# EAGLE design WorkshySwitch (EAGLE 9.4.2)
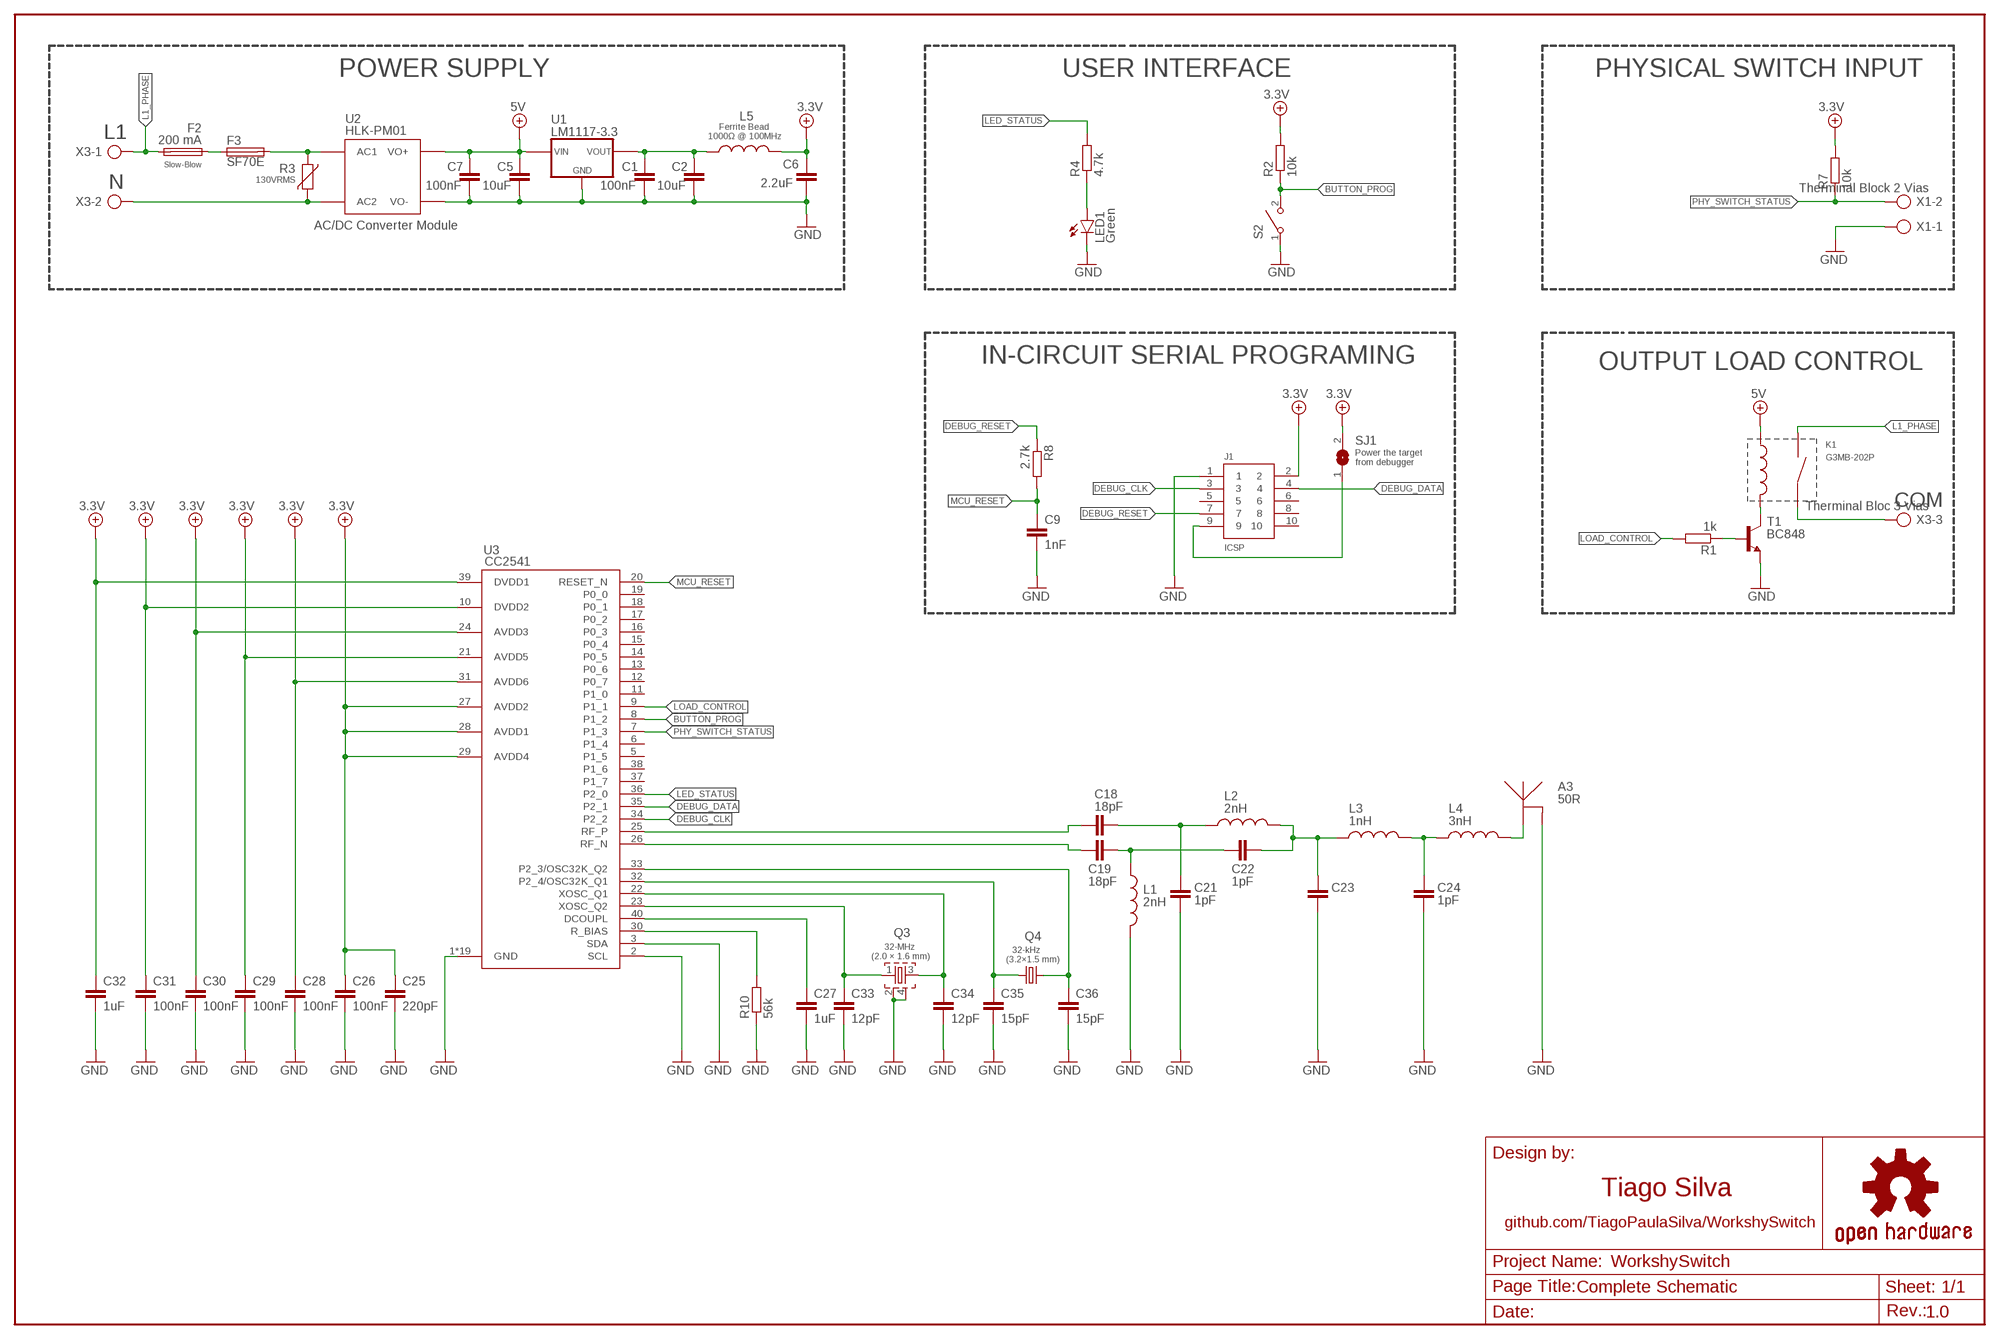
[diagram p0: schematic, sheet 1]

## Parts
A3  50R  ANTENNA  [MIFA]
C1  100nF  C-EUC0603  [C0603]
C2  10uF  C-EUC0603  [C0603]
C5  10uF  C-EUC0603  [C0603]
C6  2.2uF  C0402  [C0402]
C7  100nF  C-EUC0603  [C0603]
C9  1nF  C0402  [C0402]
C18  18pF  C0402  [C0402]
C19  18pF  C0402  [C0402]
C21  1pF  C0402  [C0402]
C22  1pF  C0402  [C0402]
C23  C0402  [C0402]
C24  1pF  C0402  [C0402]
C25  220pF  C0402  [C0402]
C26  100nF  C0402  [C0402]
C27  1uF  C0402  [C0402]
C28  100nF  C0402  [C0402]
C29  100nF  C0402  [C0402]
C30  100nF  C0402  [C0402]
C31  100nF  C0402  [C0402]
C32  1uF  C0402  [C0402]
C33  12pF  C0402  [C0402]
C34  12pF  C0402  [C0402]
C35  15pF  C0402  [C0402]
C36  15pF  C0402  [C0402]
F2  200 mA  QPL  [QPL]
F3  SF70E  LITTLEFUSE  [LITTLEFUSE]
J1  ICSP  SHF-105-01-X-D-SM  [SHF-105-01-X-D-SM]
K1  G3MB-202P  G3MB202PDC12  [RELAY_G3MB202PDC12]
L1  2nH  L0402  [C0402]
L2  2nH  L0402  [C0402]
L3  1nH  L0402  [C0402]
L4  3nH  L0402  [C0402]
L5  Ferrite Bead  L0402  [C0402]
LED1  Green  LEDCHIP-LED0805  [CHIP-LED0805]
Q3  32-MHz  FA-128  [FA-128]
Q4  32-kHz  KX-327-NHF  [3.2X1.5]
R1  1k  R0402  [C0402]
R2  10k  R0402  [C0402]
R3  130VRMS  VARISTORS05K11  [S05K11]
R4  4.7k  R0402  [C0402]
R7  10k  R0402  [C0402]
R8  2.7k  R0402  [C0402]
R10  56k  R0402  [C0402]
S2  434121050816  [434121050816]
SJ1  Jumper  SJ  [SJ]
T1  BC848  [SOT23]
U1  LM1117-3.3  REG1117  [SOT223]
U2  HLK-PM01  [HLK-PM01]
U3  CC2541  CC2541F256RHAT  [QFN50P600X600X100-41N]
X1  Therminal Block 2 Vias  AK500/2  [AK500/2]
X3  Therminal Bloc 3 Vias  AK500/3  [AK500/3]

## Nets
3.3: C1.1 C2.1 L5.2 U1.2(VOUT) U1.4(VOUT)
3.3V: C6.1 C25.1 C26.1 C28.1 C29.1 C30.1 C31.1 C32.1 J1.2 L5.1 R2.2 R7.2 SJ1.2 U3.10(DVDD2) U3.21(AVDD5) U3.24(AVDD3) U3.27(AVDD2) U3.28(AVDD1) U3.29(AVDD4) U3.31(AVDD6) U3.39(DVDD1)
5V: C5.1 C7.1 K1.3(+) U1.3(VIN) U2.P$4(VO+)
BUTTON_PROG: R2.1 S2.2 U3.8(P1_2)
DEBUG_CLK: J1.3 U3.34(P2_2)
DEBUG_DATA: J1.4 U3.35(P2_1)
DEBUG_RESET: J1.7 R8.1
GND [gnd]: A3.GND C1.2 C2.2 C5.2 C6.2 C7.2 C9.2 C21.2 C23.1 C24.2 C25.2 C26.2 C27.2 C28.2 C29.2 C30.2 C31.2 C32.2 C33.2 C34.2 C35.2 C36.2 J1.1 L1.2 LED1.C Q3.2 Q3.4 R10.1 S2.1 T1.2(E) U1.1(GND) U2.P$3(VO-) U3.1(GND) U3.2(SCL) U3.3(SDA) U3.4(GND) U3.41(GND) U3.42(GND) U3.43(GND) U3.44(GND) U3.45(GND) U3.46(GND) U3.47(GND) U3.48(GND) U3.49(GND) U3.50(GND) U3.51(GND) U3.52(GND) U3.53(GND) U3.54(GND) U3.55(GND) U3.56(GND) U3.57(GND) X1.1
L1_PHASE: F2.2 K1.1(L1) X3.1
LED_STATUS: R4.2 U3.36(P2_0)
LOAD_CONTROL: R1.2 U3.9(P1_1)
MCU_RESET: C9.1 R8.2 U3.20(RESET_N)
N$1: LED1.A R4.1
N$3: R3.2 U2.P$2(AC2) X3.2
N$4: F3.2 R3.1 U2.P$1(AC1)
N$5: K1.4(-) T1.3(C)
N$6: R1.1 T1.1(B)
N$8: K1.2(L2) X3.3
N$9: F2.1 F3.1
N$10: J1.9 SJ1.1
N$11: C18.1 U3.25(RF_P)
N$12: C19.1 C22.2 L1.1
N$13: C22.1 C23.2 L2.2 L3.1
N$14: C19.2 U3.26(RF_N)
N$15: C18.2 C21.1 L2.1
N$44: C24.1 L3.2 L4.1
N$45: A3.FEED L4.2
N$46: C27.1 U3.40(DCOUPL)
N$47: R10.2 U3.30(R_BIAS)
N$48: C33.1 Q3.1 U3.23(XOSC_Q2)
N$49: C34.1 Q3.3 U3.22(XOSC_Q1)
N$50: C35.1 Q4.1 U3.32(P2_4/OSC32K_Q1)
N$51: C36.1 Q4.2 U3.33(P2_3/OSC32K_Q2)
PHY_SWITCH_STATUS: R7.1 U3.7(P1_3) X1.2
Unconnected: J1.5 J1.6 J1.8 J1.10 U3.5(P1_5) U3.6(P1_4) U3.11(P1_0) U3.12(P0_7) U3.13(P0_6) U3.14(P0_5) U3.15(P0_4) U3.16(P0_3) U3.17(P0_2) U3.18(P0_1) U3.19(P0_0) U3.37(P1_7) U3.38(P1_6)

## Notes on the sheet
- POWER SUPPLY
- USER INTERFACE | PHYSICAL SWITCH INPUT
- L1 | 1000Ω @ 100MHz
- Slow-Blow
- N
- AC/DC Converter Module
- IN-CIRCUIT SERIAL PROGRAMING | OUTPUT LOAD CONTROL
- Power the target
  from debugger
- COM
- (2.0 × 1.6 mm)
- (3.2×1.5 mm)
- Tiago Silva
- github.com/TiagoPaulaSilva/WorkshySwitch
- Complete Schematic
- 1.0

## Library data of the parts
A3 = PCB Antenna:ANTENNA: This is a PCB Inverted F Antenna (IFA). This IFA was designed to match an impedance of 50 ohms at 2.45 GHz. Thus no additional matching components are necessary. This is a copy of CC2511 USB dongle reference design.
C1 C2 C5 C7 = rcl:C-EU: CAPACITOR, European symbol; SPICEPREFIX: C
C6 C9 C18 C19 C21-C36 = smd-ipc:C0402
F2 = fuse:QPL: Fuseholder for Micro(TM) Fuse or Pico(R) II Fuses 281 005, 281 008 Source:www.littlefuse.com .. 281005A.PDF; OC_FARNELL: 1608231; OC_NEWARK: unknown
F3 = fuse:LITTLEFUSE: LITTLEFUSE Picofuse/slow Littlefuse; OC_FARNELL: unknown; OC_NEWARK: unknown
J1 = SHF-105-01-X-D-SM:SHF-105-01-X-D-SM: 0.050"X0.050" SHROUDED TERMINAL STRIP ASSEMBLY, 10PINS.; AVAILABILITY: Unavailable; DESCRIPTION: SHF Series .050 Shrouded Terminal Strip For FFSD; MF: Samtec; MP: SHF-105-01-F-D-SM; PACKAGE: None; PRICE: None
K1 = G3MB202PDC12:G3MB202PDC12: Relay 12vdc Isolation Photot; AVAILABILITY: Unavailable; DESCRIPTION: Relay • Solid-State • Phototriac • Base: PCB terminal • Amperage: 2 AMP • Coil Voltage: 24 Vdc • Configuration: SPST-...; MF: Omron Automation; MP: G3MB-202P-DC12; PACKAGE: SIP-4 Omron; PRICE: None
L1-L5 = smd-ipc:L0402
LED1 = led:LED: LED OSRAM: - CHIPLED LG R971, LG N971, LY N971, LG Q971, LY Q971, LO R971, LY R971 LH N974, LH R974 LS Q976, LO Q976, LY Q976 LO Q996 - Hyper CHIPLED LW Q18S LB Q993, LB Q99A, LB R99A - SideLED LS A670, LO A670, LY A670, LG A670, LP A670 LB A673, LV A673, LT A673, LW A673 LH A674 LY A675 LS A676, LA A676, LO A676, LY A676, LW A676 LS A679, LY A679, LG A679 - Hyper Micro SIDELED® LS Y876, LA Y876, LO Y876, LY Y876 LT Y87S - SmartLED LW L88C, LW L88S LB L89C, LB L89S, LG L890 LS L89K, LO L89K, LY L89K LS L896, LA L896, LO L896, LY L896 - TOPLED LS T670, LO T670, LY T670, LG T670, LP T670 LSG T670, LSP T670, LSY T670, LOP T670, LYG T670 LG T671, LOG T671, LSG T671 LB T673, LV T673, LT T673, LW T673 LH T674 LS T676, LA T676, LO T676, LY T676, LB T676, LH T676, LSB T676, LW T676 LB T67C, LV T67C, LT T67C, LS T67K, LO T67K, LY T67K, LW E67C LS E67B, LA E67B, LO E67B, LY E67B, LB E67C, LV E67C, LT E67C LW T67C LS T679, LY T679, LG T679 LS T770, LO T770, LY T770, LG T770, LP T770 LB T773, LV T773, LT T773, LW T773 LH T774 LS E675, LA E675, LY E675, LS T675 LS T776, LA T776, LO T776, LY T776, LB T776 LHGB T686 LT T68C, LB T68C - Hyper Mini TOPLED® LB M676 - Mini TOPLED Santana® LG M470 LS M47K, LO M47K, LY M47K Source: http://www.osram.convergy.de LUXEON: - LUMILED® LXK2-PW12-R00, LXK2-PW12-S00, LXK2-PW14-U00, LXK2-PW14-V00 LXK2-PM12-R00, LXK2-PM12-S00, LXK2-PM14-U00 LXK2-PE12-Q00, LXK2-PE12-R00, LXK2-PE12-S00, LXK2-PE14-T00, LXK2-PE14-U00 LXK2-PB12-K00, LXK2-PB12-L00, LXK2-PB12-M00, LXK2-PB14-N00, LXK2-PB14-P00, LXK2-PB14-Q00 LXK2-PR12-L00, LXK2-PR12-M00, LXK2-PR14-Q00, LXK2-PR14-R00 LXK2-PD12-Q00, LXK2-PD12-R00, LXK2-PD12-S00 LXK2-PH12-R00, LXK2-PH12-S00 LXK2-PL12-P00, LXK2-PL12-Q00, LXK2-PL12-R00 Source: www.luxeon.com KINGBRIGHT: KA-3528ASYC Source: www.kingbright.com
Q3 = crystal:FA-: MHz RANGE CRYSTAL UNIT Source: Epson Toyocom
Q4 = crystal-geyer_V1_0:KX-327: Tuning Fork Crystals (kHz) SMD: KX327 - Serie Model Size l/w/h [mm] Frequency Range Frequency Stability Temp. Range [°C] Load Capacitance AECQ 200 availabel Datasheet KX-327VT KX-327FT KX-327RT KX-327NHT KX-327NHF KX-327L KX-327S 1.25/1.05/0.5 1.6/1.0/0.5 2.0/1.2/0.6 3.2/1.5/0.8 3.2/1.5/0.8 7.0/1.5/1.4 8.2/3.8/2.5 32,768 kHz 32,768 kHz 32,768 kHz 32,768 kHz 32,768 kHz 32,768 kHz 32,768 kHz ±10 … ±20ppm ±10 … ±20ppm ±10 … ±20ppm ±10 … ±20ppm ±10 … ±20ppm ±10 … ±20ppm ±5 … ±20ppm (*) -40°C …+85°C (*) -40°C …+85°C (*) -40°C …+85°C (*) -40°C …+85°C (*) -40°C …+125°C (*) -40°C …+85°C (*) -40°C …+85°C 7/9/12,5 7/9/12,5 7/9/12,6 7/9/12,5 9/12,5 7/9/12,5 6/12,5 - - - - yes - - KX-327VT.pdf <http://www.geyer-electronic.de/uploads/tx_userartikelfrequenz/GEYER-KX-327VT.pdf> KX-327FT.pdf <http://www.geyer-electronic.de/uploads/tx_userartikelfrequenz/GEYER-KX-327FT.pdf> KX-327RT.pdf <http://www.geyer-electronic.de/uploads/tx_userartikelfrequenz/GEYER-KX-327RT.pdf> KX-327NHT.pdf <http://www.geyer-electronic.de/uploads/tx_userartikelfrequenz/GEYER-KX-327NHT.pdf> KX-327NHF.pdf <http://www.geyer-electronic.de/uploads/tx_userartikelfrequenz/GEYER-KX-327NHF.pdf> KX-327L.pdf <http://www.geyer-electronic.de/uploads/tx_userartikelfrequenz/GEYER-KX-327L.pdf> KX-327S.pdf <http://www.geyer-electronic.de/uploads/tx_userartikelfrequenz/GEYER-KX-327S.pdf> <http://www.geyer-electronic.de/fileadmin/template/img/logo-geyer-electronic.png> Details see: http://www.geyer-electronic.de/Frequenz-Produkte.9.0.html Created 2016-06-07, Hans Locher 2016 (C) Geyer Quartz Technology KX327VT,KX327FT,KX327RT,KX327NHT,KX327NHF,KX327S,KX327L;125105;1610;2012;3215;7015;8238;1,25x1,05,1.25x1.05;1,6x1,0,1.6x1.0;2,0x1,2,2.0x1.2;3,2x1,5,3.2x1.5;8,2x3,8,8.2x3.8,7.0x1.5,7,0x1,532.768kHz
R1 R2 R4 R7 R8 R10 = smd-ipc:R0402
R3 = varistor:VARISTOR: VARISTOR
S2 = Push Button:434121050816: 6.0x3.5 mm SMD WS-TASV <http://katalog.we-online.de/media/images/v2/Family_WS-TASV_6.0x3.jpg> Details see: http://katalog.we-online.de/em/datasheet/4341x1xxx8x6.pdf 2015 (C) Wurth Elektronik; AVAILABILITY: Unavailable; DESCRIPTION: Pushbutton 12 Vdc 0.05 A 1 x Off/_On_ Wuerth Elektronik 434121050816 momentary 1 pc_s_; MF: Wurth Electronics; MP: 434121050816; PACKAGE: None; PRICE: None
SJ1 = jumper:SJ: SMD solder JUMPER
T1 = transistor:BC848: NPN TRANSISTOR
U1 = REG1117:REG1117: 800mA and 1A Low Dropout (LDO) Positive Regulator 1.8V, 2.5V, 2.85V, 3.3V, 5V, and Adj; AVAILABILITY: Unavailable; DESCRIPTION: LDO Regulator Pos 1.25V to 13.5V 0.8A 4-Pin_3+Tab_ SOT-223 Tube; MF: Texas Instruments; MP: REG1117; PACKAGE: SOT-223-4 Texas Instruments; PRICE: None
U2 = HLK-PM01:HLK-PM01: HI-LINK Ultra-compact power module HLK-PM01 Meet UL, CE requirements Ultra-thin, ultra-small All voltage input (AC: 90 ~ 264V) Low ripple and low noise Output overload and short circuit protection High efficiency, high power density The product is designed to meet the requirements of EMC and Safety Test Low power consumption, environmental protection, no-load loss <0.1W 100% load aging and testing; AVAILABILITY: Unavailable; MF: Hi-link; MP: hlk-pm01; PACKAGE: Package Analog Devices; PRICE: None
U3 = CC2541F256RHAT:CC2541F256RHAT: SimpleLink Bluetooth Smart and Proprietary Wireless MCU 40-VQFN -40 to 85; AVAILABILITY: Unavailable; DESCRIPTION: SimpleLink Bluetooth Smart and Proprietary Wireless MCU 40-VQFN -40 to 85; MF: Texas Instruments; MP: CC2541F256RHAT; PACKAGE: VFQFN-40 Texas Instruments; PRICE: None
X1 = con-ptr500:AK500/2: CONNECTOR; OC_FARNELL: unknown; OC_NEWARK: unknown
X3 = con-ptr500:AK500/3: CONNECTOR; OC_FARNELL: unknown; OC_NEWARK: unknown

## Net classes
2 gnd: width 0.152 mm, drill 0.559 mm, clearance 0.254 mm

## Board
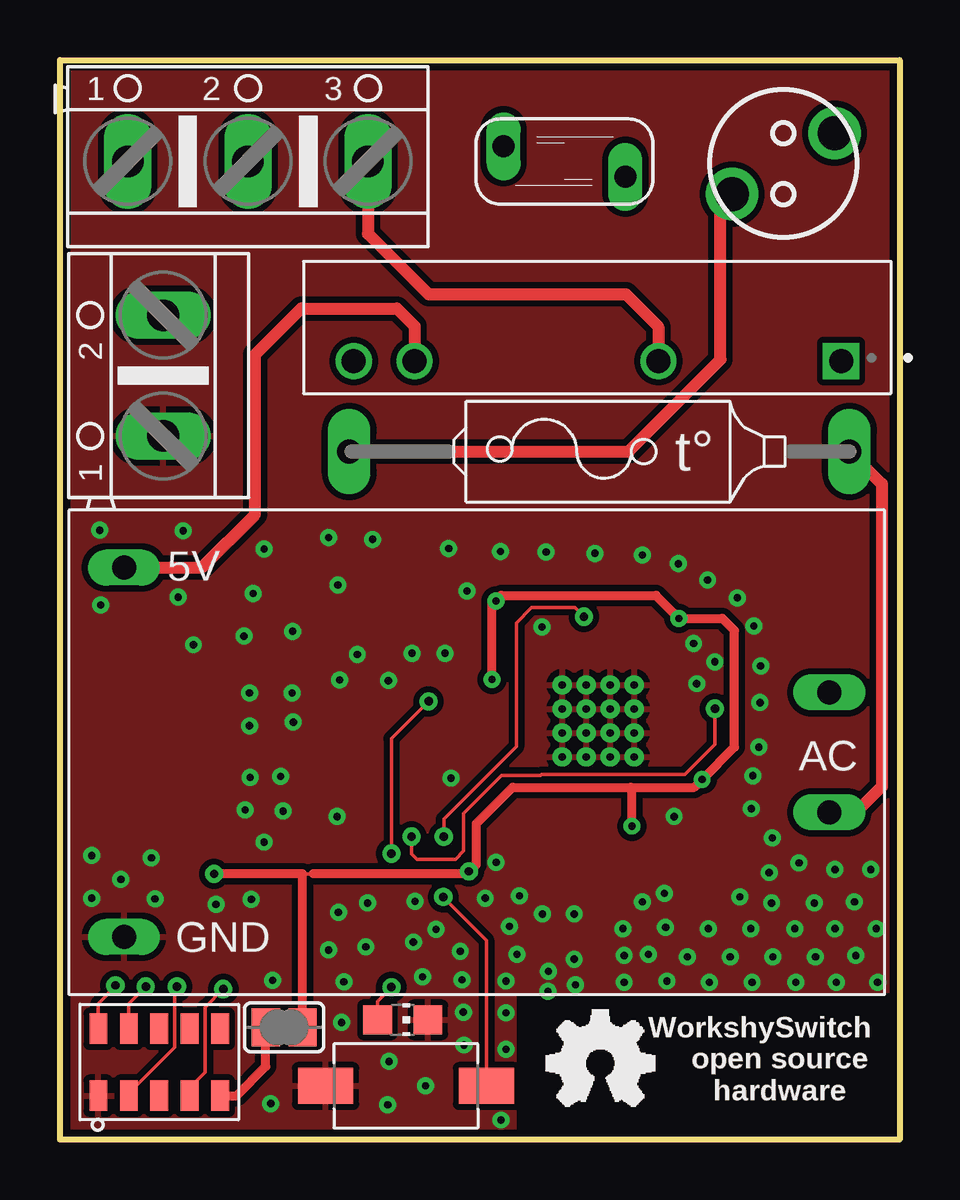
[diagram p1: board, top side]
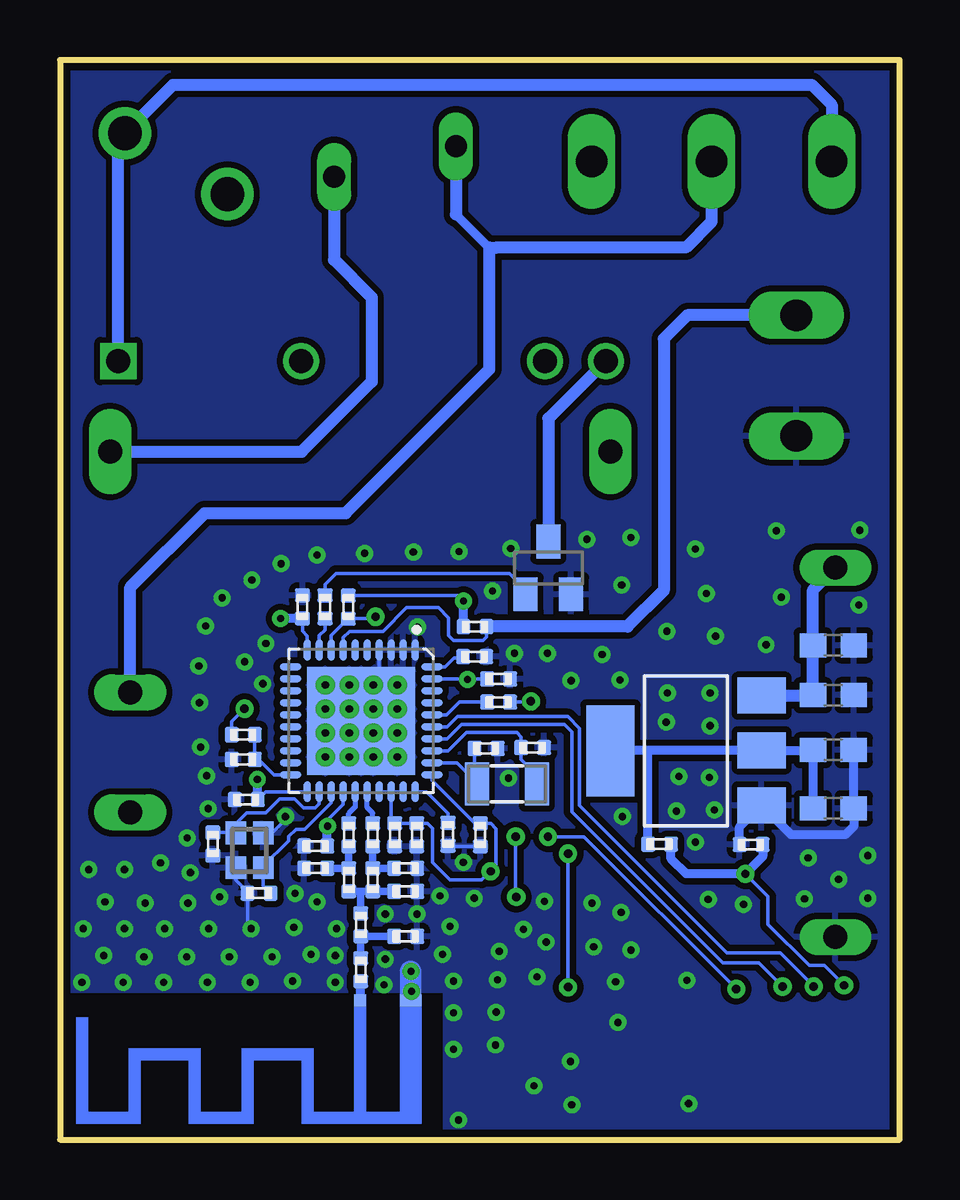
[diagram p2: board, bottom side, seen from below]

Size 35 x 45 mm. Coordinates in mm from the lower left corner, seen from the top.
Outline: 0,0 0,45 35,45 35,0 0,0
Copper layers (1*16): Top 0.035mm / dielectric 1.5mm / Bottom 0.035mm
Design rules "default *": minimum track width 6mil, minimum drill 0.3mm, track to track 6mil, track to pad 6mil, pad to pad 6mil, via to via 6mil, smd to smd 6mil, copper to edge 0.3mm, drill to drill 6mil, minimum pad ring 10mil, minimum via ring 8mil, stop-mask expansion 4mil, vias tented up to drill 0mil, thermal gap 10mil
tRestrict: area 19.1,0.3 to 34.9,6.1
bRestrict: area 19.1,0.3 to 34.9,6.1

### Footprints (pad centres in the part's own frame; a part is rotated, then mirrored left to right if it is on the bottom)
MIFA = smd 0.5 x 0.5: FEED 2.55,0.25 | smd 0.9 x 0.5: GND 0.45,0.25
C0603 = smd 1.1 x 1: 1 -0.85,0; 2 0.85,0
C0402 = smd 0.59 x 0.64: 1 -0.48,0; 2 0.48,0
QPL = drill 1.4 pad 2.184: 1 -1.27,2.139; 2 1.27,-2.139
LITTLEFUSE = drill 1 pad 1.778 long: 1 -9.88,0.2; 2 10.98,0.2
SHF-105-01-X-D-SM = smd 0.737 x 1.27: 1 -2.54,-1.27; 2 -2.54,1.524; 3 -1.27,-1.27; 4 -1.27,1.524; 5 0,-1.27; 6 0,1.524; 7 1.27,-1.27; 8 1.27,1.524; 9 2.54,-1.27; 10 2.54,1.524
RELAY_G3MB202PDC12 = drill 1 square: 1 -10.16,1.4 | drill 1: 2 -2.54,1.4; 3 7.62,1.4; 4 10.16,1.4
CHIP-LED0805 = smd 1.2 x 1.2: A 0,-1.05; C 0,1.05
FA-128 = smd 0.95 x 0.85: 1 -0.725,-0.575; 2 0.725,-0.575; 3 0.725,0.575; 4 -0.725,0.575
3.2X1.5 = smd 1 x 1.8: 1 -1.25,0; 2 1.25,0
S05K11 = drill 0.914 long: 1 -0.635,-2.54; 2 0.635,2.54
434121050816 = smd 2.3 x 1.5: 1 -3.35,0; 2 3.35,0
SJ = smd 1.168 x 1.6: 1 -0.762,0; 2 0.762,0
SOT23 = smd 1 x 1.4: 1 -0.95,-1.1; 2 0.95,-1.1; 3 0,1.1
SOT223 = smd 1.499 x 2.007: 1 -2.261,-3.15; 2 0.025,-3.15; 3 2.311,-3.15 | smd 3.81 x 2.007: 4 0,3.15
HLK-PM01 = drill 1 long: P$1 -14.7,2.5; P$2 -14.7,-2.5; P$3 14.7,7.7; P$4 14.7,-7.7
QFN50P600X600X100-41N = smd 0.9 x 0.3: 1 -2.95,2.25; 2 -2.95,1.75; 3 -2.95,1.25; 4 -2.95,0.75; 5 -2.95,0.25; 6 -2.95,-0.25; 7 -2.95,-0.75; 8 -2.95,-1.25; 9 -2.95,-1.75; 10 -2.95,-2.25; 21 2.95,-2.25; 22 2.95,-1.75; 23 2.95,-1.25; 24 2.95,-0.75; 25 2.95,-0.25; 26 2.95,0.25; 27 2.95,0.75; 28 2.95,1.25; 29 2.95,1.75; 30 2.95,2.25 | smd 0.3 x 0.9: 11 -2.25,-2.95; 12 -1.75,-2.95; 13 -1.25,-2.95; 14 -0.75,-2.95; 15 -0.25,-2.95; 16 0.25,-2.95; 17 0.75,-2.95; 18 1.25,-2.95; 19 1.75,-2.95; 20 2.25,-2.95; 31 2.25,2.95; 32 1.75,2.95; 33 1.25,2.95; 34 0.75,2.95; 35 0.25,2.95; 36 -0.25,2.95; 37 -0.75,2.95; 38 -1.25,2.95; 39 -1.75,2.95; 40 -2.25,2.95 | smd 4.5 x 4.5: 41 0,0 | drill 0.3 pad 0.6: 42 -0.5,0.5; 43 0.5,0.5; 44 0.5,-0.5; 45 -0.5,-0.5; 46 -1.5,-0.5; 47 -1.5,0.5; 48 -1.5,1.5; 49 -0.5,1.5; 50 0.5,1.5; 51 1.5,1.5; 52 1.5,0.5; 53 1.5,-0.5; 54 1.5,-1.5; 55 0.5,-1.5; 56 -0.5,-1.5; 57 -1.5,-1.5
AK500/2 = drill 1.321 long: 1 -2.515,0; 2 2.515,0
AK500/3 = drill 1.321 long: 1 -5.004,0; 2 0,0; 3 5.004,0

### Placement (x,y rotation side)
A3  19.93,6.06 180 bottom
C1  2.76,16.24 0 bottom
C2  2.76,13.81 0 bottom
C5  2.76,18.52 0 bottom
C6  6.19,12.29 180 bottom
C7  2.76,20.6 0 bottom
C9  27.36,15.85 180 bottom
C18  22.96,12.7 270 bottom
C19  21.96,12.7 90 bottom
C21  24.34,11.3 180 bottom
C22  21.96,10.82 90 bottom
C23  20.59,10.35 180 bottom
C24  20.59,8.47 0 bottom
C25  20.13,12.7 270 bottom
C26  21.05,12.7 270 bottom
C27  17.71,20.13 0 bottom
C28  17.48,12.7 270 bottom
C29  27.23,14.17 180 bottom
C30  24.34,12.23 180 bottom
C31  24.89,22.2 90 bottom
C32  16.71,19.2 0 bottom
C33  26.7,10.27 180 bottom
C34  28.63,12.32 270 bottom
C35  17.23,16.3 0 bottom
C36  15.29,16.34 0 bottom
F2  30.16,40.68 90 top
F3  21.93,28.48 0 top
J1  4.14,3.1 0 top
K1  22.41,33.85 180 top
L1  20.59,11.3 0 bottom
L2  22.96,10.82 270 bottom
L3  22.46,8.95 270 bottom
L4  22.46,7.08 270 bottom
L5  10,12.31 180 bottom
LED1  14.29,4.99 270 top
Q3  27.1,12.05 90 bottom
Q4  16.36,14.82 0 bottom
R1  23.95,22.2 270 bottom
R2  22.98,22.19 90 bottom
R3  21.03,40.77 90 top
R4  16.71,18.24 180 bottom
R7  17.7,21.38 180 bottom
R8  27.36,16.88 0 bottom
R10  18.82,12.72 90 bottom
S2  14.43,2.23 0 top
SJ1  9.35,4.68 0 top
T1  14.64,23.83 0 bottom
U1  8.9,16.2 90 bottom
U2  17.37,16.14 180 top
U3  22.44,17.45 270 bottom
X1  4.3,31.84 90 top
X3  7.83,40.78 0 top

### Tracks (layer width: path | path; a pad name or v marks a point on that pad's centre or on a via)
3.3
  Bottom 0.381: C2.1 C1.1 3.63,16.22 U1.2 10.49,16.22 | 10.49,16.22 12.03,16.22 U1.4 | L5.2 10.48,16.21 10.49,16.22
3.3V  (via drill 0.3 pad 0.6, 0.35)
  Top 0.152: J1.2 1.6,5.66 2.31,6.38 v2.31,6.43 | 10.57,11.07 9.2,11.07
  Top 0.381: 10.57,11.07 16.94,11.07 v17.05,11.18 17.07,11.18 17.35,11.46 17.35,13.16 18.87,14.68 23.8,14.68 | v6.43,11.07 9.2,11.07 10.11,11.07 SJ1.2 | 23.8,14.68 26.44,14.68 v26.77,15.01 28.12,16.36 28.12,21.21 27.61,21.72 v25.81,21.72 24.84,22.68 18.41,22.68 v18.18,22.45 18.01,22.28 v18.01,19.18 | v23.84,13.06 23.84,14.64 23.8,14.68
  Bottom 0.152: U3.24 23.19,13.97 23.86,13.31 23.86,13.04 23.86,12.92 | U3.21 26.42,14.5 C29.1 | C31.1 24.89,21.19 24.69,20.99 U3.10 | R2.2 18.39,22.67 v18.18,22.45 | U3.29 U3.28 | U3.31 19.49,14.97 17.7,13.18 C28.1 17.04,13.18 16.82,12.95 16.82,11.43 17.07,11.18 | v2.31,6.43 3.14,7.25 3.77,7.25 5.49,8.97 5.49,10.13 v6.43,11.07 | U3.28 21.19,13.36 21.21,13.34 C26.1 C25.1 19.68,13.18 19.47,12.97 19.47,11.56 18.73,10.82 17.42,10.82 17.07,11.18 | U3.27 U3.28 | C32.1 17.98,19.2 v18.01,19.18 18.03,19.2 U3.39 | v17.05,11.18 17.07,11.18
  Bottom 0.381: C31.1 v25.81,21.72 | R7.2 v18.18,22.45 | C30.1 23.86,12.92 | 23.86,13.04 v23.84,13.06 | C29.1 26.75,14.99 v26.77,15.01 | C6.1 5.7,11.8 v6.43,11.07 8.89,11.07 9.52,11.71 L5.1
5V
  Top 0.508: U2.P$4 5.91,23.84 8.13,26.06 8.13,32.72 10.06,34.65 14.05,34.65 14.79,33.91 K1.3
  Bottom 0.508: U1.3 3.62,18.51 C5.1 C7.1 3.61,22.9 U2.P$4
BUTTON_PROG  (via drill 0.35)
  Top 0.152: v21.84,21.79 21.46,22.17 19.66,22.17 19.02,21.54 19.02,16.38 16,13.36 v16,12.62 | S2.2 17.78,8.31 v15.98,10.11
  Bottom 0.152: U3.8 23.69,21 R2.1 21.93,21.71 v21.84,21.79 | v16,12.62 16,10.13 v15.98,10.11
DEBUG_CLK  (via drill 0.35)
  Top 0.152: J1.3 2.87,1.93 4.78,3.84 4.78,6.25 4.89,6.36 v4.88,6.38
  Bottom 0.152: U3.34 18.86,16.7 18.25,17.3 13.97,17.3 13.66,16.99 13.66,13.66 7.37,7.37 5.87,7.37 v4.88,6.38
DEBUG_DATA  (via drill 0.35)
  Top 0.152: J1.4 2.87,5.66 v3.58,6.38
  Bottom 0.152: U3.35 18.86,17.2 18.43,17.63 13.82,17.63 13.34,17.14 13.34,13.92 7.19,7.77 4.98,7.77 v3.58,6.38
DEBUG_RESET  (via drill 0.35)
  Top 0.152: J1.7 5.41,2.16 6.04,2.79 6.04,5.51 v6.81,6.27 | v14.66,12.62 14.66,11.91 14.88,11.68 16.48,11.68 16.83,12.03 16.83,13.6 18.4,15.18 20.03,15.18 20.07,15.22 26.06,15.22 27.3,16.46 v27.3,17.96
  Bottom 0.152: v6.81,6.27 13.16,12.62 v14.66,12.62 | R8.1 27.84,17.43 27.32,17.96 v27.3,17.96
GND  (via drill 0.3 pad 0.6)
  Bottom 0.152: Q3.4 27.67,10.82 27.15,10.3 C33.2 27.18,8.94 v27.03,8.79 | U3.4 21.69,19.2 U3.47 | R10.1 18.8,12.22 C28.2 | U3.43 U3.42 | U3.41 U3.45 | Q3.2 26.16,12.78 25.6,13.34 v25.6,13.46
  Bottom 0.381: C1.2 C2.2 1.91,13.05 2.26,12.7 4.52,12.7 U1.1 6.67,13.02 C6.2
  Bottom 0.813: 20.38,7 v20.37,7.01
  Bottom 0.897: A3.GND 20.38,7
  other vias: 23.52,6.55 25.3,6.6 34.09,6.55 32.36,6.55 30.68,6.55 28.85,6.55 27.08,6.55 23.52,7.67 26.16,7.62 27.94,7.62 29.72,7.62 31.5,7.62 33.17,7.67 23.47,8.79 25.25,8.84 34.04,8.79 32.31,8.79 30.63,8.79 28.8,8.79 24.28,9.91 25.2,10.26 28.35,10.11 29.67,9.86 31.45,9.86 33.12,9.91 29.57,11.13 30.81,11.53 32.31,11.25 33.81,11.25 29.69,12.57 28.88,15.16 28.83,13.79 24.54,7.72 21.49,6.45 21.44,7.52 20.35,6.17 18.59,3.76 18.59,5.28 18.59,6.6 19.05,7.72 18.75,8.89 21.44,9.4 20.12,9.4 19.15,10.16 17.73,10.06 8.51,12.4 1.32,11.84 6.5,9.8 18.19,11.56 16.31,15.06 16.05,20.27 20.09,21.36 26.42,20.68 26.54,19 27.3,19.91 16.84,3.94 16.81,5.31 16.76,6.65 16.69,7.85 15.67,8.76 14.81,9.93 14.73,8.23 15.11,6.78 12.83,9.86 11.61,9.47 11.2,7.9 12.75,8.03 11.84,6.58 11.73,4.88 13.72,3.25 13.67,1.45 11.56,13.46 8.86,6.63 7.98,10.01 9.3,13.69 9.19,15.14 7.92,15.09 7.72,13.74 3.81,11.73 1.32,10.06 3.96,10.03 8.79,1.5 15.24,2.24 18.39,0.81 7.9,17.25 7.9,18.62 9.68,18.62 9.73,17.4 29.21,19.74 29.18,18.21 29.13,16.36 28.93,21.41 28.24,22.58 27,23.32 25.78,24 24.28,24.36 22.3,24.43 16.97,22.86 18.36,24.51 20.27,24.49 16.21,24.64 13.03,25.02 11.2,25.1 11.58,23.11 9.7,21.18 12.4,20.22 14.68,20.27 13.69,19.13 8.51,24.61 8.05,22.76 4.93,22.61 5.56,20.62 7.67,20.98 5.13,25.37 1.65,25.4 1.7,22.28 2.54,10.85 11.66,19.15
  pour Top: 0,0 0,45 35,45 35,0
  pour Bottom: 0,0 35,0 35,45 0,45
L1_PHASE
  Bottom 0.508: K1.1 32.57,41.68 F2.2 30.28,43.96 3.66,43.96 2.83,43.13 X3.1
LED_STATUS
  Bottom 0.152: U3.36 18.88,17.7 18.34,18.24 R4.2
LOAD_CONTROL
  Bottom 0.152: U3.9 24.19,21.01 23.95,21.25 R1.2
MCU_RESET
  Bottom 0.152: U3.20 26.08,15.2 26.88,16 R8.2 C9.1
N$1  (via drill 0.35)
  Top 0.152: v15.37,18.26 13.82,16.71 v13.82,11.91 | v13.82,6.35 13.82,6.34 13.24,5.75 LED1.A
  Bottom 0.152: R4.1 15.39,18.24 v15.37,18.26 | v13.82,11.91 v13.82,6.35
N$3
  Bottom 0.152: 17.07,37.16 17.09,37.16
  Bottom 0.381: 16.79,37.19 17.07,37.19 17.09,37.16 18.49,38.56
  Bottom 0.508: X3.2 7.83,38.27 8.91,37.19 16.79,37.19 17.09,37.19 | 17.07,37.16 17.09,37.19 | U2.P$2 32.07,23.02 28.98,26.11 23.09,26.11 17.09,32.11 17.09,37.16 17.09,37.19 | R3.2 18.49,38.56
N$4
  Top 0.508: U2.P$1 33.19,13.64 34.27,14.71 34.27,27.33 F3.2
  Bottom 0.508: F3.2 24.92,28.68 22,31.59 22,35.1 23.58,36.67 23.57,36.68 R3.1
N$5
  Bottom 0.508: K1.4 14.64,30.05 T1.3
N$6
  Bottom 0.152: R1.1 23.95,23.14 23.5,23.6 16.26,23.6 15.59,22.93 T1.1
N$8
  Top 0.508: X3.3 12.84,37.76 15.37,35.23 23.6,35.23 24.95,33.88 K1.2
N$9
  Top 0.508: F3.1 23.7,28.68 27.53,32.51 27.53,38.92 F2.1
N$10
  Top 0.381: J1.9 7.37,1.83 8.58,3.05 SJ1.1
N$11
  Bottom 0.203: U3.25 22.69,13.86 22.96,13.59 C18.1
N$12
  Bottom 0.305: C19.1 C22.2 L1.1
N$13
  Bottom 0.152: C23.2 C22.1 22.52,10.35
  Bottom 0.305: C23.2 22.52,10.35 | 22.52,10.35 L2.2 | L3.1 22.46,10.28 22.52,10.35
N$14
  Bottom 0.203: C19.2 21.96,13.61 22.19,13.84 U3.26
N$15
  Bottom 0.305: C18.2 L2.1 C21.1
N$44
  Bottom 0.305: L4.1 L3.2 C24.1
N$45
  Bottom 0.152: L4.2 22.46,5.83 A3.FEED
  Bottom 0.305: 22.48,5.9 22.48,5.87 22.46,5.88 L4.2
  Bottom 0.381: L4.2 22.48,6.58 22.48,5.9
N$46
  Bottom 0.152: U3.40 18.95,19.7 18.57,20.08 18.24,20.08 C27.1
N$47
  Bottom 0.152: U3.30 19.72,14.5 18.82,13.6 R10.2
N$48
  Bottom 0.152: U3.23 23.69,14.03 24.79,12.93 25.16,12.93 25.46,12.63 25.46,12.46 26.52,11.4 Q3.1 26.52,10.57 C33.1
N$49
  Bottom 0.152: U3.22 24.19,13.98 24.36,13.82 24.84,13.82 25.22,14.2 25.84,14.2 26.43,13.61 27.21,13.61 27.67,13.15 Q3.3 27.69,12.8 C34.1
N$50
  Bottom 0.152: 17.53,14.91 17.38,15.06 17.71,15.4 C35.1 | 17.53,14.91 Q4.1 | U3.32 18.44,15.7 17.65,14.91 17.53,14.91
N$51
  Bottom 0.152: U3.33 18.82,16.2 18.05,16.97 15.95,16.97 15.77,16.79 C36.1 15.77,15.85 15.12,15.19 Q4.2
PHY_SWITCH_STATUS
  Bottom 0.152: U3.7 23.19,20.93 22.93,21.19 21.54,21.19 20.55,22.17 19.23,22.17 18.8,21.74 18.8,21.01 18.59,20.8 17.36,20.8 17.22,20.95 R7.1
  Bottom 0.508: X1.2 8.85,34.36 9.83,33.38 9.83,22.89 11.33,21.38 R7.1

### Text on the board
tPlace: WorkshySwitch | open source / hardware